# Altium schematic sheet Heirarchy.SchDoc
size D
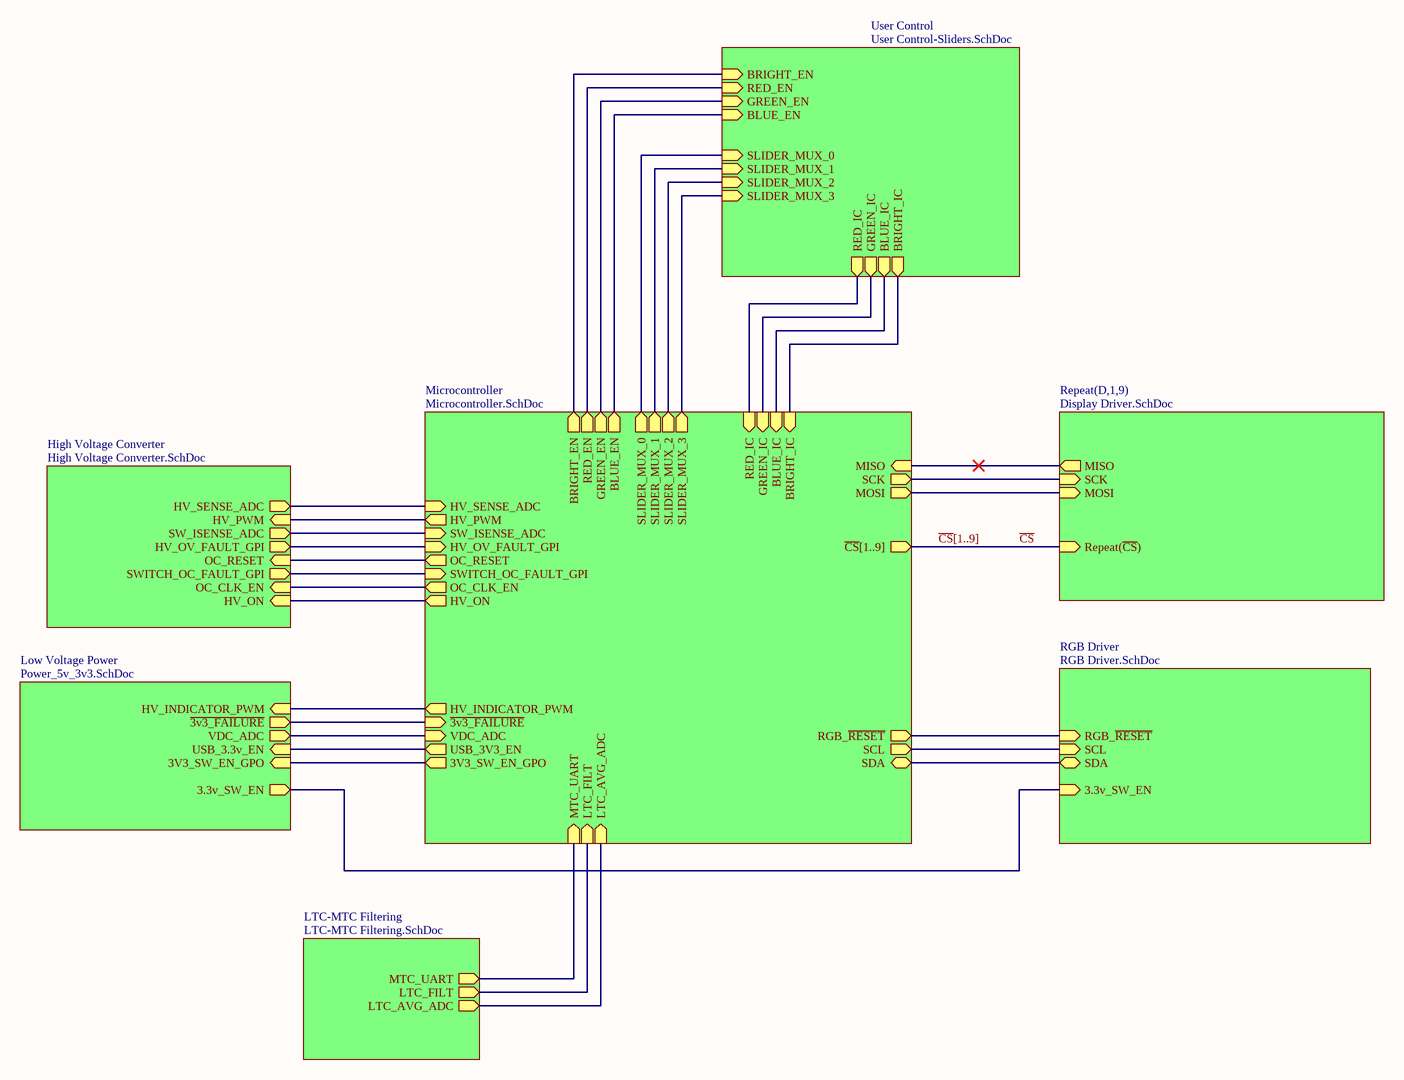
[diagram p0: Heirarchy.SchDoc]

## Sub-sheets
High Voltage Converter = High Voltage Converter.SchDoc: HV_SENSE_ADC (out), HV_PWM (in), SW_ISENSE_ADC (out), HV_OV_FAULT_GPI (out), OC_RESET (in), SWITCH_OC_FAULT_GPI (out), OC_CLK_EN (in), HV_ON (in)
Low Voltage Power = Power_5v_3v3.SchDoc: HV_INDICATOR_PWM (in), ~{3v3_FAILURE} (out), VDC_ADC (out), USB_3.3v_EN (in), 3V3_SW_EN_GPO (in), 3.3v_SW_EN (out)
LTC-MTC Filtering = LTC-MTC Filtering.SchDoc: LTC_FILT (out), MTC_UART (out), LTC_AVG_ADC (out)
Microcontroller = Microcontroller.SchDoc: HV_PWM (out), SW_ISENSE_ADC (in), HV_INDICATOR_PWM (out), HV_OV_FAULT_GPI (in), VDC_ADC (in), HV_SENSE_ADC (in), ~{3v3_FAILURE} (in), ~{CS}[1..9] (out), USB_3V3_EN (out), RGB_~{RESET} (out), SCL (out), SDA (bidir), 3V3_SW_EN_GPO (out), MISO (in), MOSI (out), SCK (out), MTC_UART (in), LTC_FILT (in), LTC_AVG_ADC (in), BRIGHT_EN (out), RED_EN (out), BLUE_EN (out), GREEN_EN (out), SLIDER_MUX_0 (out), SLIDER_MUX_1 (out), SLIDER_MUX_2 (out), SLIDER_MUX_3 (out), RED_IC (in), BLUE_IC (in), BRIGHT_IC (in), GREEN_IC (in), OC_RESET (out), SWITCH_OC_FAULT_GPI (in), OC_CLK_EN (out), HV_ON (out)
Repeat(D,1,9) = Display Driver.SchDoc: Repeat(~{CS}) (in), MISO (out), SCK (in), MOSI (in)
RGB Driver = RGB Driver.SchDoc: RGB_~{RESET} (in), SCL (in), SDA (bidir), 3.3v_SW_EN (in)
User Control = User Control-Sliders.SchDoc: SLIDER_MUX_1 (in), BLUE_IC (out), BLUE_EN (in), GREEN_EN (in), BRIGHT_EN (in), SLIDER_MUX_0 (in), RED_EN (in), SLIDER_MUX_2 (in), SLIDER_MUX_3 (in), RED_IC (out), GREEN_IC (out), BRIGHT_IC (out)

## Nets
~{CS}: sheet Repeat(D,1,9)/Repeat(~{CS})
(unnamed): sheet Microcontroller/HV_PWM, sheet High Voltage Converter/HV_PWM
(unnamed): sheet Microcontroller/SW_ISENSE_ADC, sheet High Voltage Converter/SW_ISENSE_ADC
(unnamed): sheet Microcontroller/HV_INDICATOR_PWM, sheet Low Voltage Power/HV_INDICATOR_PWM
(unnamed): sheet Microcontroller/HV_OV_FAULT_GPI, sheet High Voltage Converter/HV_OV_FAULT_GPI
(unnamed): sheet Microcontroller/VDC_ADC, sheet Low Voltage Power/VDC_ADC
(unnamed): sheet Microcontroller/HV_SENSE_ADC, sheet High Voltage Converter/HV_SENSE_ADC
(unnamed): sheet Microcontroller/~{3v3_FAILURE}, sheet Low Voltage Power/~{3v3_FAILURE}
(unnamed): sheet Microcontroller/USB_3V3_EN, sheet Low Voltage Power/USB_3.3v_EN
(unnamed): sheet Microcontroller/RGB_~{RESET}, sheet RGB Driver/RGB_~{RESET}
(unnamed): sheet Microcontroller/SCL, sheet RGB Driver/SCL
(unnamed): sheet Microcontroller/SDA, sheet RGB Driver/SDA
(unnamed): sheet Microcontroller/3V3_SW_EN_GPO, sheet Low Voltage Power/3V3_SW_EN_GPO
(unnamed): sheet Microcontroller/MISO, sheet Repeat(D,1,9)/MISO
(unnamed): sheet Microcontroller/MOSI, sheet Repeat(D,1,9)/MOSI
(unnamed): sheet Microcontroller/SCK, sheet Repeat(D,1,9)/SCK
(unnamed): sheet Microcontroller/MTC_UART, sheet LTC-MTC Filtering/MTC_UART
(unnamed): sheet Microcontroller/LTC_FILT, sheet LTC-MTC Filtering/LTC_FILT
(unnamed): sheet Microcontroller/LTC_AVG_ADC, sheet LTC-MTC Filtering/LTC_AVG_ADC
(unnamed): sheet Microcontroller/BRIGHT_EN, sheet User Control/BRIGHT_EN
(unnamed): sheet Microcontroller/RED_EN, sheet User Control/RED_EN
(unnamed): sheet Microcontroller/BLUE_EN, sheet User Control/BLUE_EN
(unnamed): sheet Microcontroller/GREEN_EN, sheet User Control/GREEN_EN
(unnamed): sheet Microcontroller/SLIDER_MUX_0, sheet User Control/SLIDER_MUX_0
(unnamed): sheet Microcontroller/SLIDER_MUX_1, sheet User Control/SLIDER_MUX_1
(unnamed): sheet Microcontroller/SLIDER_MUX_2, sheet User Control/SLIDER_MUX_2
(unnamed): sheet Microcontroller/SLIDER_MUX_3, sheet User Control/SLIDER_MUX_3
(unnamed): sheet Microcontroller/RED_IC, sheet User Control/RED_IC
(unnamed): sheet Microcontroller/BLUE_IC, sheet User Control/BLUE_IC
(unnamed): sheet Microcontroller/BRIGHT_IC, sheet User Control/BRIGHT_IC
(unnamed): sheet Microcontroller/GREEN_IC, sheet User Control/GREEN_IC
(unnamed): sheet Microcontroller/OC_RESET, sheet High Voltage Converter/OC_RESET
(unnamed): sheet Microcontroller/SWITCH_OC_FAULT_GPI, sheet High Voltage Converter/SWITCH_OC_FAULT_GPI
(unnamed): sheet Microcontroller/OC_CLK_EN, sheet High Voltage Converter/OC_CLK_EN
(unnamed): sheet Microcontroller/HV_ON, sheet High Voltage Converter/HV_ON
(unnamed): sheet Low Voltage Power/3.3v_SW_EN, sheet RGB Driver/3.3v_SW_EN

## Buses and harness runs
bus ~{CS}[1..9] = sheet Microcontroller/~{CS}[1..9]